# EAGLE schematic pm25 (EAGLE 9.3.2)
AUTHOR: Jared Wolff; BOARD_NUMBER: BRD-0010; COMPANY: Circuit Dojo; DOC_NUMBER: SCH-0010; DOC_REV: 1; TITLE: Particle^2 Sensor
Assembly variants: Production
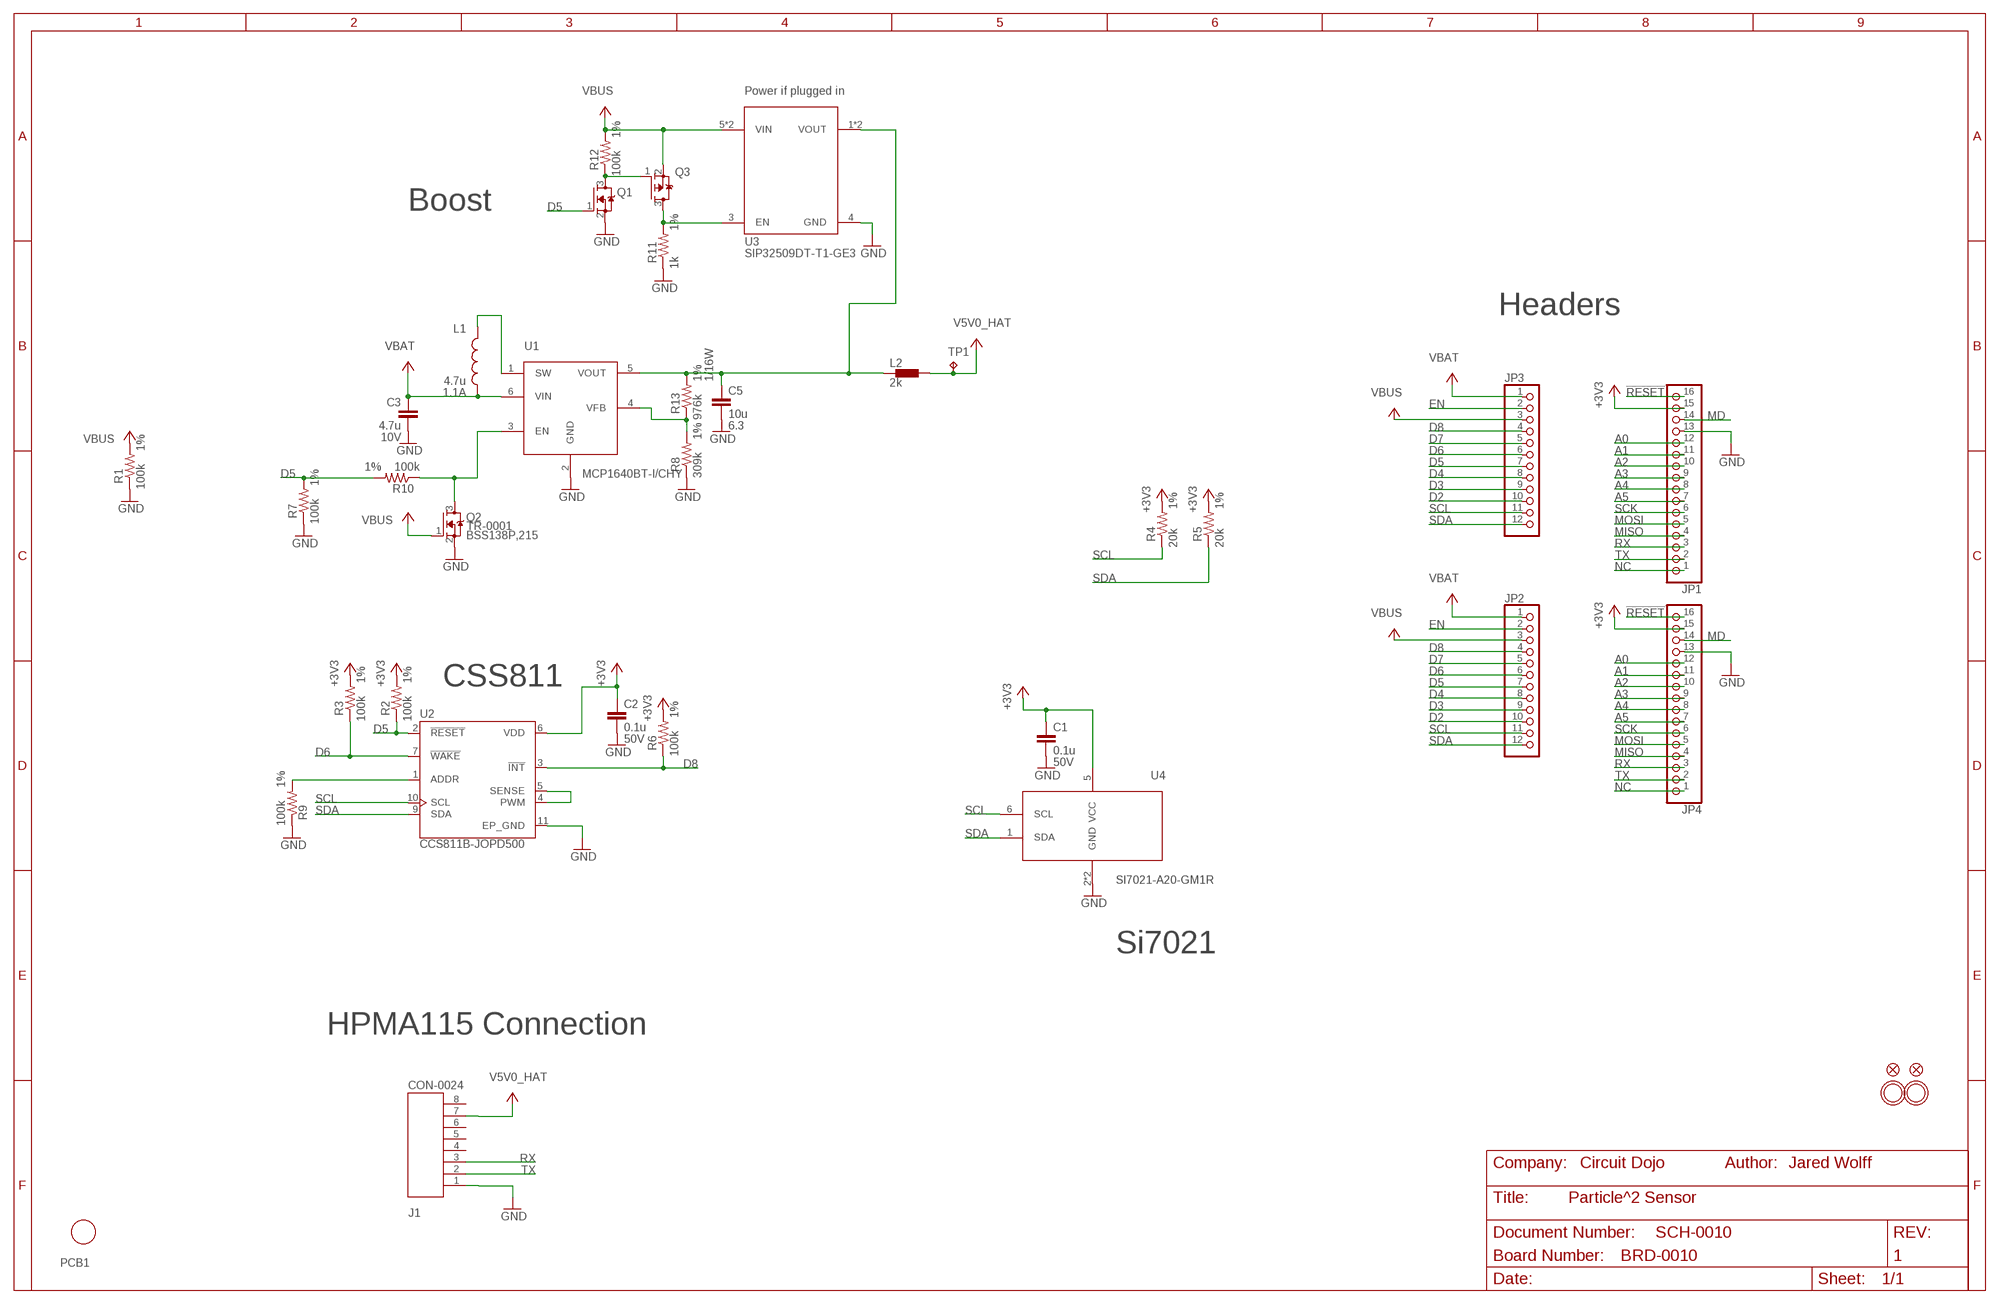
[diagram p0: schematic, sheet 1]

## Parts
C1  0.1u  CAP-0017  [CAPC1005X55N]
C2  0.1u  CAP-0017  [CAPC1005X55N]
C3  4.7u  CAP-0010  [C0603]
C5  10u  CAP-10U-6.3V-0603  [C0603]
J1  CON-0024  [0532610871]
JP1  HEADER-1X16ROUND  [1X16_ROUND]
JP2  HEADER-1X12  [1X12_ROUND]  (not fitted in variant Production)
JP3  HEADER-1X12  [1X12_ROUND]
JP4  HEADER-1X16ROUND  [1X16_ROUND]  (not fitted in variant Production)
L1  4.7u  IND-0003  [IND-2P0X2P0X1P2]
L2  2k  FERRITE-0805  [R0805]
PCB1  PCB-PS-CCS811-SI7021  [PLACEHOLDER]
Q1  TR-0001  [SOT23]
Q2  TR-0001  [SOT23]
Q3  TR-0003  [SOT23]
R1  100k  RES-0041  [R0402]  (not fitted in variant Production)
R2  100k  RES-0041  [R0402]
R3  100k  RES-0041  [R0402]
R4  20k  RES-0054  [R0402]
R5  20k  RES-0054  [R0402]
R6  100k  RES-0041  [R0402]
R7  100k  RES-0041  [R0402]
R8  309k  RES-309K-1%-0402  [R0402]
R9  100k  RES-0041  [R0402]
R10  100k  RES-0041  [R0402]
R11  1k  RES-1K-1%-0402  [R0402]
R12  100k  RES-0041  [R0402]
R13  976k  RES-976K-1%-0402  [R0402]
TP1  TP  [TP-1P27]
U1  POWER-VREG-FB-EN-SW-350MA  [SOT23-6]
U2  CCS811B-JOPD500  [SON60P400X270X110-11N]
U3  POWER-SWITCH-SIP32509DT  [SOT23-6]
U4  SI7021-A20-GM1R  [SON100P300X300X80-7N]
U$31  MOUNTINGHOLE2.5  [MOUNTINGHOLE_2.5_PLATED]
U$32  MOUNTINGHOLE2.5  [MOUNTINGHOLE_2.5_PLATED]
U$34  FIDUCIAL""  [FIDUCIAL_1MM]
U$35  FIDUCIAL""  [FIDUCIAL_1MM]

## Nets
!RESET: JP1.16 JP4.16
+3V3: C1.1 C2.1 JP1.15 JP4.15 R2.2 R3.2 R4.2 R5.2 R6.2 U2.6(VDD) U4.5(VCC)
A0: JP1.12 JP4.12
A1: JP1.11 JP4.11
A2: JP1.10 JP4.10
A3: JP1.9 JP4.9
A4: JP1.8 JP4.8
A5: JP1.7 JP4.7
D2: JP2.10 JP3.10
D3: JP2.9 JP3.9
D4: JP2.8 JP3.8
D5: JP2.7 JP3.7 Q1.1(G) R2.1 R7.2 R10.2 U2.2(!RESET)
D6: JP2.6 JP3.6 R3.1 U2.7(!WAKE)
D7: JP2.5 JP3.5
D8: JP2.4 JP3.4 R6.1 U2.3(!INT)
EN: JP2.2 JP3.2
GND: C1.2 C2.2 C3.2 C5.2 J1.1 JP1.13 JP4.13 Q1.2(S) Q2.2(S) R1.1 R7.1 R8.1 R9.1 R11.1 U1.2(GND) U2.11(EP_GND) U3.4(GND) U4.2(GND) U4.7(GND)
MD: JP1.14 JP4.14
MISO: JP1.4 JP4.4
MOSI: JP1.5 JP4.5
N$1: L1.P$1 U1.1(SW)
N$2: R8.2 R13.1 U1.4(VFB)
N$3: Q1.3(D) Q3.1(G) R12.1
N$4: R9.2 U2.1(ADDR)
N$5: U2.4(PWM) U2.5(SENSE)
N$6: Q2.3(D) R10.1 U1.3(EN)
N$7: Q3.3(D) R11.2 U3.3(EN)
NC: JP1.1 JP4.1
RX: J1.3 JP1.3 JP4.3
SCK: JP1.6 JP4.6
SCL: JP2.11 JP3.11 R4.1 U2.10(SCL) U4.6(SCL)
SDA: JP2.12 JP3.12 R5.1 U2.9(SDA) U4.1(SDA)
TX: J1.2 JP1.2 JP4.2
V5V0_BEAD: C5.1 L2.1 R13.2 U1.5(VOUT) U3.1(VOUT) U3.2(VOUT)
V5V0_HAT: J1.7 L2.2 TP1.P$1(TP) TP1.P$2(TP) TP1.TP
VBAT: C3.1 JP2.1 JP3.1 L1.P$2 U1.6(VIN)
VBUS: JP2.3 JP3.3 Q2.1(G) Q3.2(S) R1.2 R12.2 U3.5(VIN) U3.6(VIN)
Unconnected: J1.4 J1.5 J1.6 J1.8

## Notes on the sheet
- Power if plugged in
- Boost
- Headers
- CSS811
- Si7021
- HPMA115 Connection

## Library data of the parts
C1 C2 = wolff-den:CAP-0017: CAP CER 0.1UF 35V X5R 0402; DESC: CAP CER 0.1UF 50V X5R 0402; DIGIKEYPN: 587-3499-1-ND; MF: Taiyo Yuden; MPN: UMK105BJ104KV-F; VOLTHIGH: 50V
C3 = wolff-den:CAP-0010: CAP CER 4.7UF 10V X5R 0603; DIGIKEYPN: 1276-6684-1-ND; MPN: CL10A475MP5LNNC; TEMPHIGH: 85; TEMPLOW: -55; VOLTHIGH: 10V
C5 = wolff-den:CAP: CAPACITOR; DESC: CAP CER 10UF 6.3V X5R 0603; DIGIKEYPN: 587-5869-1-ND; MPN: JMK107ABJ106MA-T; VOLTHIGH: 6.3
J1 = wolff-den:CON-0024; DESC: CONN HEADER SMD R/A 8POS 1.25MM; DIGIKEYPN: WM7626CT-ND; MPN: 0532610871
JP1 = microbuilder:HEADER-1X16: PIN HEADER; MPN: PPPC161LFBN-RC
JP2 = microbuilder:HEADER-1X12
JP3 = microbuilder:HEADER-1X12; MPN: PPPC121LFBN-RC
JP4 = microbuilder:HEADER-1X16: PIN HEADER
L1 = wolff-den:IND-0003: FIXED IND 4.7UH 750MA 390 MOHM; CURRENT: 1.1A; DIGIKEYPN: 587-4705-1-ND; MPN: NRV2012T4R7MGF
L2 = wolff-den:FERRITE: FERRITE BEAD; DESC: FERRITE BEAD 2 KOHM 0805 1LN; DIGIKEYPN: 1276-6330-1-ND; MPN: CIM21J202NE
PCB1 = wolff-den:PCB; MPN: BRD-0010
Q1 Q2 = wolff-den:TR-0001: MOSFET N-CH 60V 360MA TO-236AB; DIGIKEYPN: 1727-1142-1-ND; MPN: BSS138P,215; TEMPHIGH: 150; TEMPLOW: -55
Q3 = wolff-den:TR-0003: MOSFET P-CH 50V 130MA SOT23-3; DIGIKEYPN: BSS84-FDICT-ND; MPN: BSS84-7-F; TEMPHIGH: 150; TEMPLOW: -55
R1-R3 R6 R7 R9 R10 R12 = wolff-den:RES-0041: RES SMD 100K OHM 1% 1/16W 0402; DIGIKEYPN: 311-100KLRCT-ND; MPN: RC0402FR07100KL; TOLERANCE: 1%; VENDOR: Yageo
R4 R5 = wolff-den:RES-0054: RES SMD 20K OHM 1% 1/16W 0402; DIGIKEYPN: 311-20.0KLRCT-ND; MPN: RC0402FR-0720KL; TOLERANCE: 1%; VENDOR: Yageo
R8 = wolff-den:RES: RESISTOR; DESC: RES SMD 309K OHM 1% 1/16W 0402; DIGIKEYPN: YAG3108CT-ND; MPN: RC0402FR-07309KL; POWER: 1/16W; TOLERANCE: 1%
R11 = wolff-den:RES: RESISTOR; DESC: RES SMD 1K OHM 1% 1/5W 0402; DIGIKEYPN: 541-2888-1-ND; MPN: RCS04021K00FKED; POWER: 1/5W; TOLERANCE: 1%
R13 = wolff-den:RES: RESISTOR; DESC: RES SMD 976K OHM 1% 1/16W 0402; DIGIKEYPN: YAG3265CT-ND; MPN: RC0402FR-07976KL; POWER: 1/16W; TOLERANCE: 1%
TP1 = wolff-den:TP: TEST POINT
U1 = wolff-den:POWER-VREG-FB-EN-SW: IC CONV BOOST SOT-23-6; DIGIKEYPN: MCP1640BT-I/CHYCT-ND; MPN: MCP1640BT-I/CHY; TEMPHIGH: 125; TEMPLOW: -40; VOLTHIGH: 5.5V; VOLTLOW: 0.8V
U2 = wolff-den:CCS811B-JOPD500: Low Power Digital Sensor For Ind; DESC: Low Power Digital Sensor For Ind; DIGIKEYPN: CCS811B-JOPD500CT-ND; MF: ams; MPN: CCS811B-JOPD500
U3 = wolff-den:POWER-SWITCH: IC SWITCH; DESC: IC LOAD SWITCH SOT23-6; DIGIKEYPN: SIP32509DT-T1-GE3CT-ND; MPN: SIP32509DT-T1-GE3
U4 = wolff-den:SI7021-A20-GM1R; DESC: SENS HUMID/TEMP 3.6V I2C 2% 6DFN; DIGIKEYPN: 336-4380-1-ND; MPN: SI7021-A20-GM1R
U$31 U$32 = microbuilder:MOUNTINGHOLE: Mounting Hole For #2 screws (0.086"/2.18mm width, 0.094"/2.4mm hole) use 2.5mm; BOM: EXCLUDE
U$34 U$35 = microbuilder:FIDUCIAL: Fiducial Alignment Points Various fiducial points for machine vision alignment.; BOM: EXCLUDE